# Altium schematic sheet Connections.SchDoc
size B; SheetNumber: 2; SheetTotal: 3
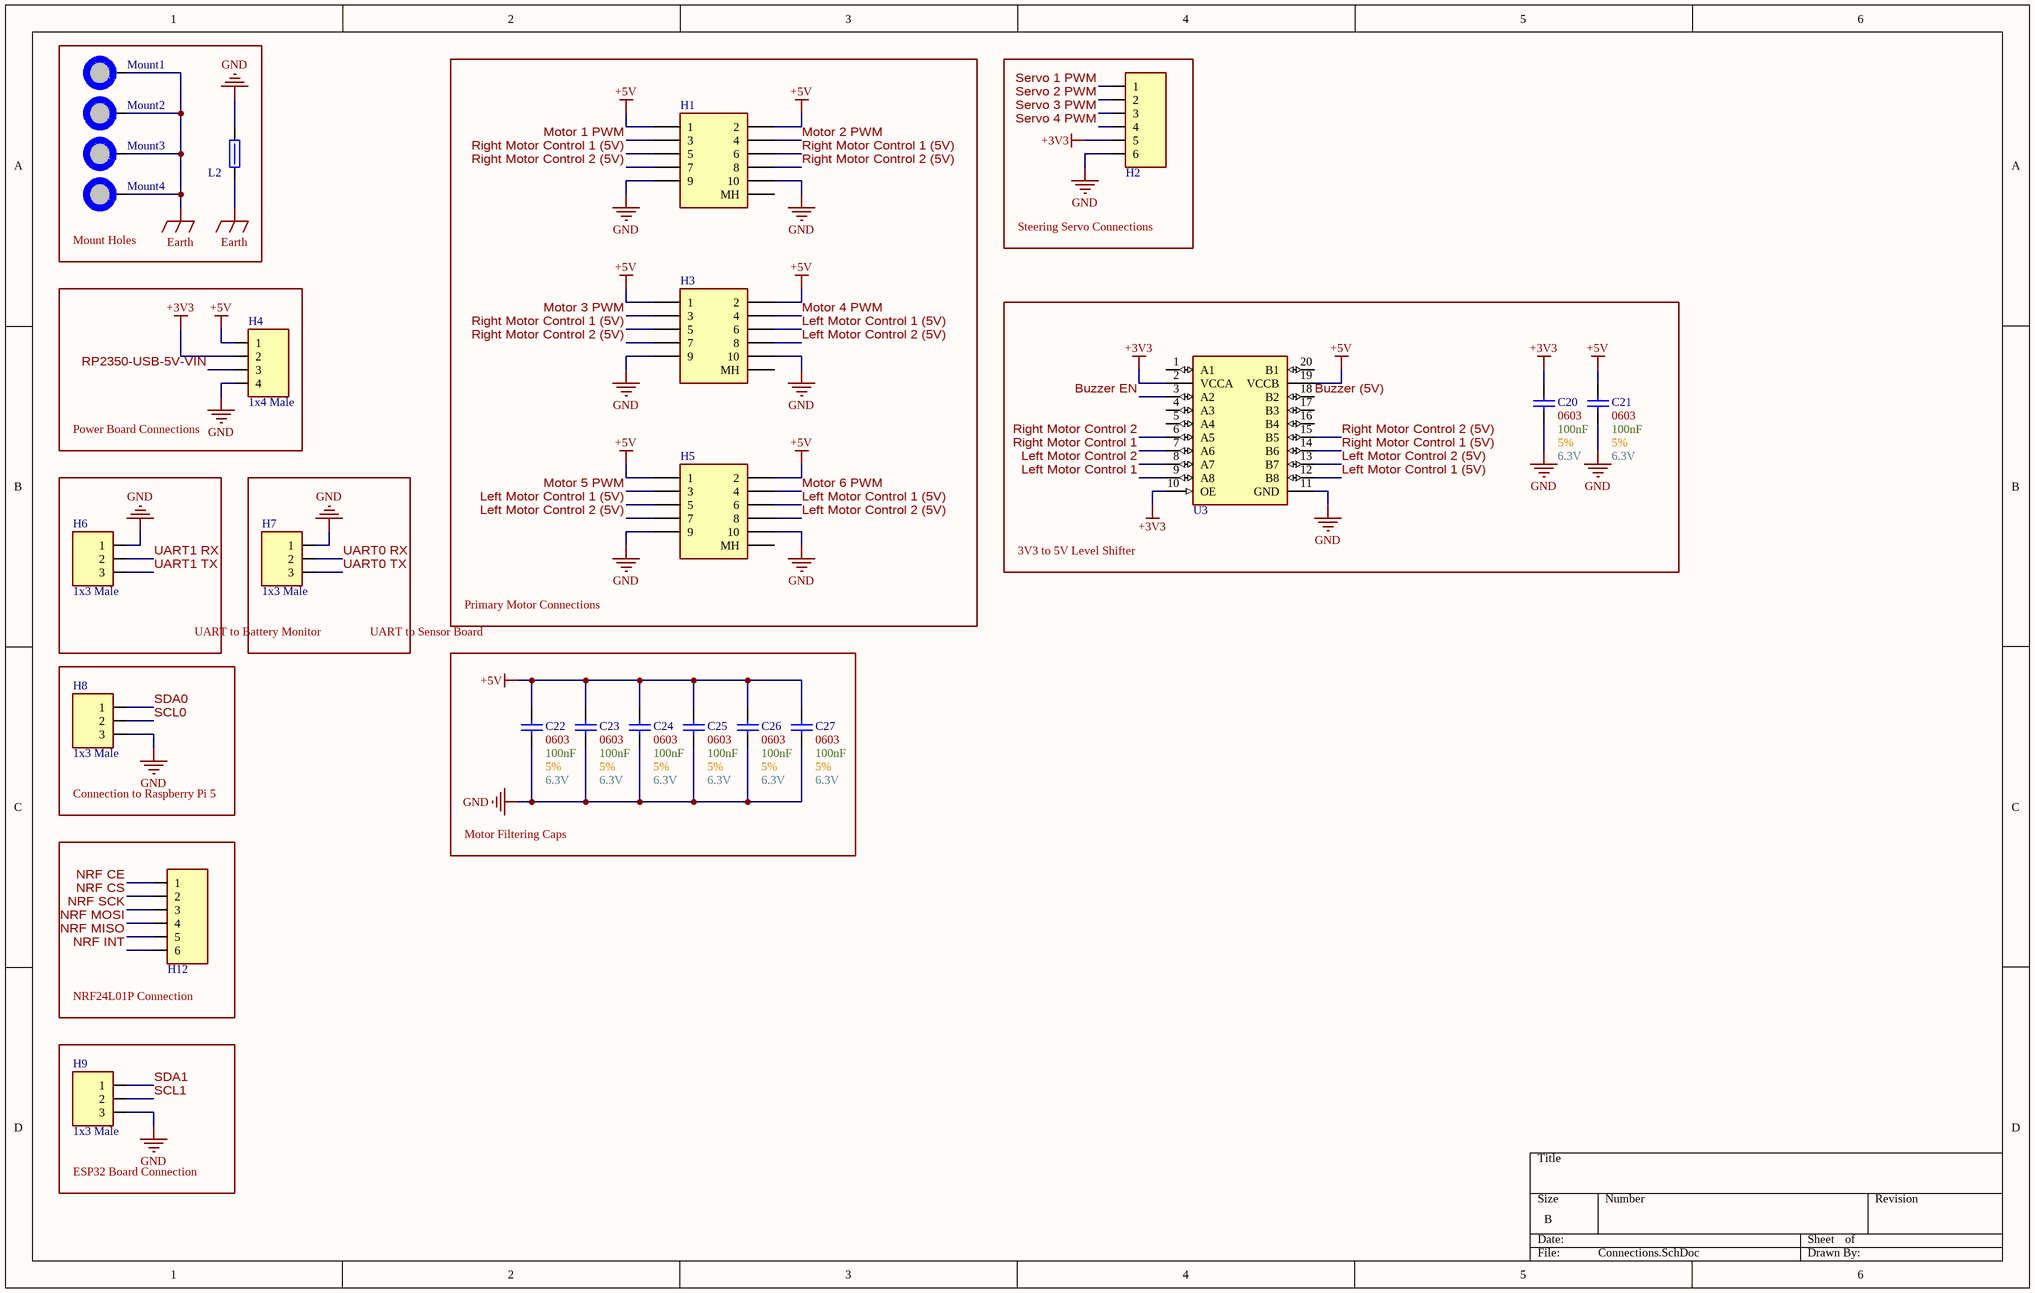
[diagram p0: Connections.SchDoc]

## Parts
C20  Size Package: 0603  Capacitance: 100nF  Voltage: 6.3V  Tolerance: 5%  [[Cap] SMD 0603]  (hidden comment: [Cap] SMD Nonpolarized)
C21  Size Package: 0603  Capacitance: 100nF  Voltage: 6.3V  Tolerance: 5%  [[Cap] SMD 0603]  (hidden comment: [Cap] SMD Nonpolarized)
C22  Size Package: 0603  Capacitance: 100nF  Voltage: 6.3V  Tolerance: 5%  [[Cap] SMD 0603]  (hidden comment: [Cap] SMD Nonpolarized)
C23  Size Package: 0603  Capacitance: 100nF  Voltage: 6.3V  Tolerance: 5%  [[Cap] SMD 0603]  (hidden comment: [Cap] SMD Nonpolarized)
C24  Size Package: 0603  Capacitance: 100nF  Voltage: 6.3V  Tolerance: 5%  [[Cap] SMD 0603]  (hidden comment: [Cap] SMD Nonpolarized)
C25  Size Package: 0603  Capacitance: 100nF  Voltage: 6.3V  Tolerance: 5%  [[Cap] SMD 0603]  (hidden comment: [Cap] SMD Nonpolarized)
C26  Size Package: 0603  Capacitance: 100nF  Voltage: 6.3V  Tolerance: 5%  [[Cap] SMD 0603]  (hidden comment: [Cap] SMD Nonpolarized)
C27  Size Package: 0603  Capacitance: 100nF  Voltage: 6.3V  Tolerance: 5%  [[Cap] SMD 0603]  (hidden comment: [Cap] SMD Nonpolarized)
H1  [Header] Shrouded 2x5 SMD  [[Header] Shrouded 2x5 SMD]  (value not drawn)
H2  [Header] Shrouded 1x6 Male  [[Header] Shrouded 1x6 Male]  (value not drawn)
H3  [Header] Shrouded 2x5 SMD  [[Header] Shrouded 2x5 SMD]  (value not drawn)
H4  1x4 Male  [[Header] Shrouded 1x4 Male]
H5  [Header] Shrouded 2x5 SMD  [[Header] Shrouded 2x5 SMD]  (value not drawn)
H6  1x3 Male  [[Header] Shrouded 1x3 Male]
H7  1x3 Male  [[Header] Shrouded 1x3 Male]
H8  1x3 Male  [[Header] Shrouded 1x3 Male]
H9  1x3 Male  [[Header] Shrouded 1x3 Male]
H12  [Header] Shrouded 1x6 Male  [[Header] Shrouded 1x6 Male]  (value not drawn)
L2  652-MH2029-300Y  [[Ferrite] SMD Bead 0805 (1)]  (value not drawn)
Mount1  M3 Mount Hole  [[Mount] M3 Mount Hole]  (value not drawn)  (no BOM)
Mount2  M3 Mount Hole  [[Mount] M3 Mount Hole]  (value not drawn)  (no BOM)
Mount3  M3 Mount Hole  [[Mount] M3 Mount Hole]  (value not drawn)  (no BOM)
Mount4  M3 Mount Hole  [[Mount] M3 Mount Hole]  (value not drawn)  (no BOM)
U3  [IC] Level Shifter (2)  [[IC] Level Shifter (2)]  (value not drawn)

## Blocks framed on the sheet
Mount Holes: L2 Mount1-Mount4
Primary Motor Connections: H1 H3 H5
Steering Servo Connections: H2
Power Board Connections: H4
3V3 to 5V Level Shifter: C20 C21 U3
UART to Battery Monitor: H6
UART to Sensor Board: H7
Connection to Raspberry Pi 5: H8
Motor Filtering Caps: C22-C27
NRF24L01P Connection: H12
ESP32 Board Connection: H9

## Nets
+3V3: C20.2 H2.5 H4.2 U3.2(VCCA) U3.10(OE)
+5V: C21.2 C22.2 C23.2 C24.2 C25.2 C26.2 C27.2 H1.1 H1.2 H3.1 H3.2 H4.1 H5.1 H5.2 U3.19(VCCB)
Earth: L2.1 Mount1.1 Mount2.1 Mount3.1 Mount4.1
GND: C20.1 C21.1 C22.1 C23.1 C24.1 C25.1 C26.1 C27.1 H1.9 H1.10 H2.6 H3.9 H3.10 H4.4 H5.9 H5.10 H6.1 H7.1 H8.3 H9.3 L2.2 U3.11(GND)
Buzzer (5V): U3.18(B2)
Buzzer EN: U3.3(A2)
Left Motor Control 1: U3.9(A8)
Left Motor Control 1 (5V): H3.6 H5.5 H5.6 U3.12(B8)
Left Motor Control 2: U3.8(A7)
Left Motor Control 2 (5V): H3.8 H5.7 H5.8 U3.13(B7)
Motor 1 PWM: H1.3
Motor 2 PWM: H1.4
Motor 3 PWM: H3.3
Motor 4 PWM: H3.4
Motor 5 PWM: H5.3
Motor 6 PWM: H5.4
NRF CE: H12.1
NRF CS: H12.2
NRF INT: H12.6
NRF MISO: H12.5
NRF MOSI: H12.4
NRF SCK: H12.3
Right Motor Control 1: U3.7(A6)
Right Motor Control 1 (5V): H1.5 H1.6 H3.5 U3.14(B6)
Right Motor Control 2: U3.6(A5)
Right Motor Control 2 (5V): H1.7 H1.8 H3.7 U3.15(B5)
RP2350-USB-5V-VIN: H4.3
SCL0: H8.2
SCL1: H9.2
SDA0: H8.1
SDA1: H9.1
Servo 1 PWM: H2.1
Servo 2 PWM: H2.2
Servo 3 PWM: H2.3
Servo 4 PWM: H2.4
UART0 RX: H7.2
UART0 TX: H7.3
UART1 RX: H6.2
UART1 TX: H6.3

Not connected (* = marked no-connect by the designer): H1 X(MH); H3 X(MH); H5 X(MH); U3 1(A1) 4(A3) 5(A4) 16(B4) 17(B3) 20(B1)

## Library data of the parts
H2 H12 = [Header] Shrouded 1x6 Male: 0705430005 / Mates with 0050579406; Supplier 1: DigiKey; Supplier 2: DigiKey; Supplier Part Number 1: WM4804-ND; Supplier Part Number 2: WM2904-ND
H4 = [Header] Shrouded 1x4 Male: 70543-0003 / Mates with 005057-9404; Supplier 1: Avnet; Supplier Part Number 1: 0705430003
H6-H9 = [Header] Shrouded 1x3 Male: 070543-0037 / Mates with 005057-9403; Supplier 1: DigiKey; Supplier Part Number 1: WM4825-ND
  H7-H9: Supplier 2: DigiKey; Supplier Part Number 2: WM2901-ND
L2 = [Ferrite] SMD Ferrite Bead (1): Res @ Freq: 30 @ 100MHz; Size Package: 0805
Mount1-Mount4 = [Mount] M3 Mount Hole: Place at least 4.5mm from board edge. Plated.
U3 = [IC] Level Shifter (2): TXS0108EQPWRQ1; Supplier 1: DigiKey; Supplier Part Number 1: 296-42401-1-ND
C20-C27 = [Cap] SMD Nonpolarized: Supplier 1: DigiKey; Supplier Part Number 1: 311-1088-6-ND
H1 H3 H5 = [Header] Shrouded 2x5 SMD: Supplier 1: DigiKey; Supplier Part Number 1: WM4227-ND